# EAGLE design WagaGSM (EAGLE 8.7.1)

## Sheet 1 of 2: PROCESOR BOARD
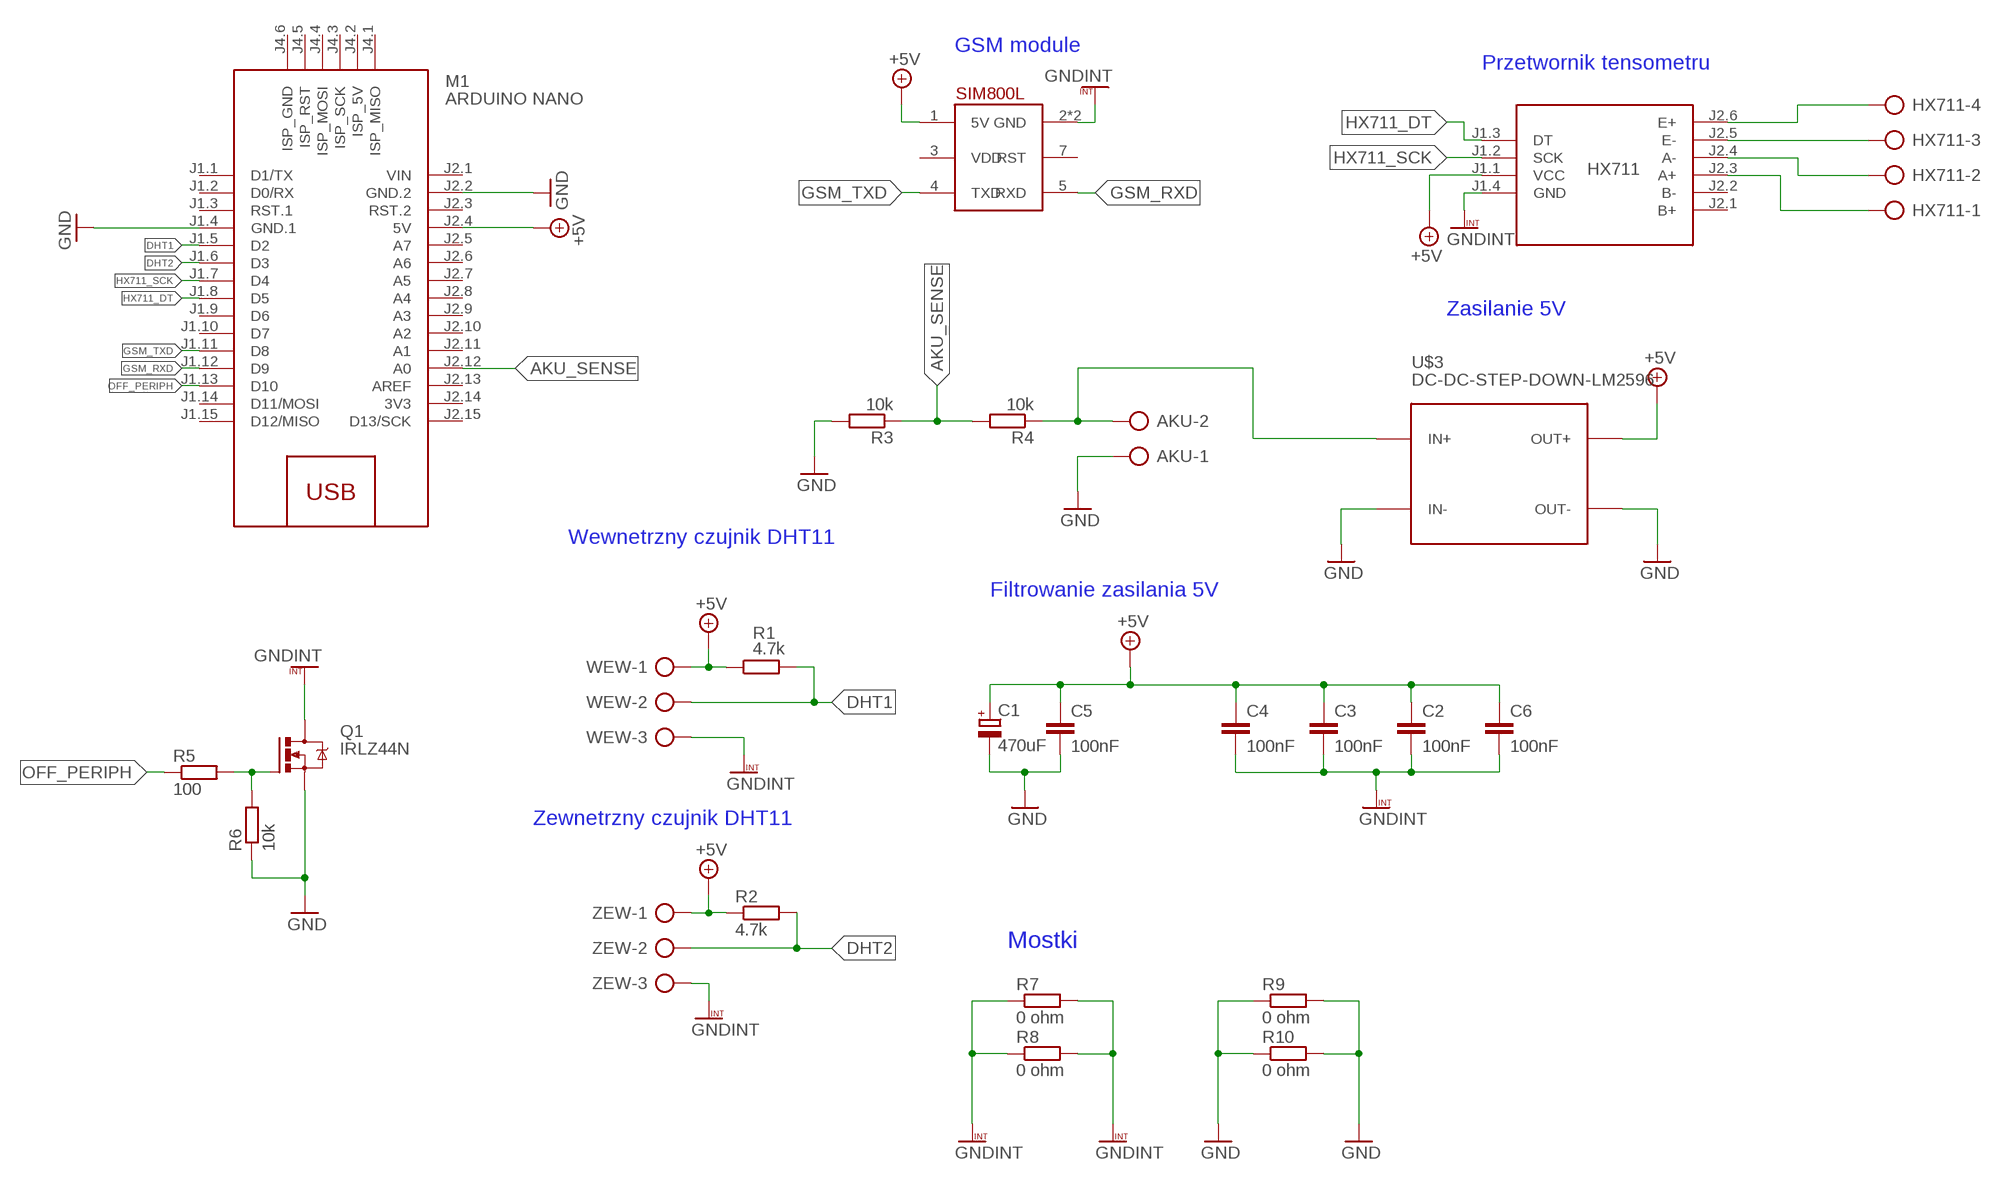
[diagram p0: schematic, sheet 1]

### Parts
AKU  AK500/2-H  [AK500/2-H]
C1  470uF  CPOL-EUE5-10.5  [E5-10,5]
C2  100nF  C-EU050-030X075  [C050-030X075]
C3  100nF  C-EU050-030X075  [C050-030X075]
C4  100nF  C-EU050-030X075  [C050-030X075]
C5  100nF  C-EU050-030X075  [C050-030X075]
C6  100nF  C-EU050-030X075  [C050-030X075]
HX711  AK300/4  [AK300/4]
M1  ARDUINO NANO  ARDUINO-NANO-3.0#ISP  [ARDUINO-NANO-3.0#ISP]
Q1  IRLZ44N  IRFZ48Z  [TO220BH]
R1  4.7k  R-EU_0204/7  [0204/7]
R2  4.7k  R-EU_0204/7  [0204/7]
R3  10k  R-EU_0207/10  [0207/10]
R4  10k  R-EU_0207/10  [0207/10]
R5  100  R-EU_0207/7  [0207/7]
R6  10k  R-EU_0207/7  [0207/7]
R7  0 ohm  R-EU_0204/7  [0204/7]
R8  0 ohm  R-EU_0204/7  [0204/7]
R9  0 ohm  R-EU_0204/7  [0204/7]
R10  0 ohm  R-EU_0204/7  [0204/7]
U$1  SIM800L  [SIP]
U$2  HX711  [HX711]
U$3  DC-DC-STEP-DOWN-LM2596  [DC-DC-STEP-DOWN-LM2596]
WEW  AK500/3-H  [AK500/3-H]
ZEW  AK500/3-H  [AK500/3-H]

### Nets
+5V: C1.+ C2.1 C3.1 C4.1 C5.1 C6.1 M1.J2.4(5V) R1.1 R2.1 U$1.1(5V) U$2.J1.1(VCC) U$3.OUT+ WEW.1 ZEW.1
AKU_SENSE: M1.J2.12(A0) R3.1 R4.2
DHT1: M1.J1.5(D2) R1.2 WEW.2
DHT2: M1.J1.6(D3) R2.2 ZEW.2
GND: AKU.1 C1.- C5.2 M1.J1.4(GND.1) M1.J2.2(GND.2) Q1.S R3.2 R6.1 R9.1 R9.2 R10.1 R10.2 U$3.IN- U$3.OUT-
GNDINT: C2.2 C3.2 C4.2 C6.2 Q1.D R7.1 R7.2 R8.1 R8.2 U$1.2(GND) U$1.6(GND) U$2.J1.4(GND) WEW.3 ZEW.3
GSM_RXD: M1.J1.12(D9) U$1.5(RXD)
GSM_TXD: M1.J1.11(D8) U$1.4(TXD)
HX711_DT: M1.J1.8(D5) U$2.J1.3(DT)
HX711_SCK: M1.J1.7(D4) U$2.J1.2(SCK)
N$1: Q1.G R5.2 R6.2
N$3: AKU.2 R4.1 U$3.IN+
N$9: HX711.4 U$2.J2.6(E+)
N$10: HX711.3 U$2.J2.5(E-)
N$11: HX711.2 U$2.J2.4(A-)
N$12: HX711.1 U$2.J2.3(A+)
OFF_PERIPH: M1.J1.13(D10) R5.1
Unconnected: M1.J1.1(D1/TX) M1.J1.2(D0/RX) M1.J1.3(RST.1) M1.J1.9(D6) M1.J1.10(D7) M1.J1.14(D11/MOSI) M1.J1.15(D12/MISO) M1.J2.3(RST.2) M1.J2.5(A7) M1.J2.6(A6) M1.J2.7(A5) M1.J2.8(A4) M1.J2.9(A3) M1.J2.10(A2) M1.J2.11(A1) M1.J2.13(AREF) M1.J2.15(D13/SCK) M1.J4.1(ISP_MISO) M1.J4.2(ISP_5V) M1.J4.3(ISP_SCK) M1.J4.4(ISP_MOSI) M1.J4.5(ISP_RST) M1.J4.6(ISP_GND) U$1.3(VDD) U$1.7(RST) U$2.J2.1(B+)

### Notes on the sheet
- GSM module
- Przetwornik tensometru
- Zasilanie 5V
- Wewnetrzny czujnik DHT11
- Filtrowanie zasilania 5V
- Zewnetrzny czujnik DHT11
- Mostki

## Sheet 2 of 2: SUPPLY BOARD

## Power pins joined to a net without a drawn wire
3V3: M1.J2.14(3V3)
B-: U$2.J2.2(B-)
VIN: M1.J2.1(VIN)

## Library data of the parts
AKU = con-ptr500:AK500/2-H: CONNECTOR Aug. 2004 / PTR Meßtechnik: Die Bezeichnung der Serie AK505 wurde geändert. Es handelt sich hierbei um AK500 in horizontaler Ausführung.; OC_FARNELL: unknown; OC_NEWARK: unknown
C1 = rcl:CPOL-EU: POLARIZED CAPACITOR, European symbol
C2-C6 = rcl:C-EU: CAPACITOR, European symbol
HX711 = con-ptr500:AK300/4: CONNECTOR; OC_FARNELL: unknown; OC_NEWARK: unknown
M1 = 000_diy-modules:ARDUINO-NANO-3.0#ISP: Arduino Nano 3.0 (and compatible devices) with ISP pads More details available here: https://www.arduino.cc/en/Main/ArduinoBoardNano Click here to find device on ebay.com <http://www.ebay.com/sch/arduino+nano>
Q1 = transistor-power:IRFZ48: N Channel HEXFET® Power MOSFET Logic Level Source: http://www.irf.com/product-info/datasheets/data/irfz48z.pdf
R1-R10 = rcl:R-EU_: RESISTOR, European symbol
U$1 = SIM800L:SIM800L: SIM800L Blue EVB Board with Level Translation and diode dropper.
U$2 = 000_MojeElementy:HX711: Płytka z układem HX711 do obługi belek tensometrycznych
U$3 = 000_diy-modules:DC-DC-STEP-DOWN-LM2596: DC/DC Step-Down Regulator based on LM2596-ADJ chip LM2596 datasheet available here: http://www.ti.com/lit/ds/symlink/lm2596.pdf Click here to find device on ebay.com <http://www.ebay.com/sch/lm2596+power+regulator>
WEW ZEW = con-ptr500:AK500/3-H: CONNECTOR Aug. 2004 / PTR Meßtechnik: Die Bezeichnung der Serie AK505 wurde geändert. Es handelt sich hierbei um AK500 in horizontaler Ausführung.; OC_FARNELL: unknown; OC_NEWARK: unknown

## Board
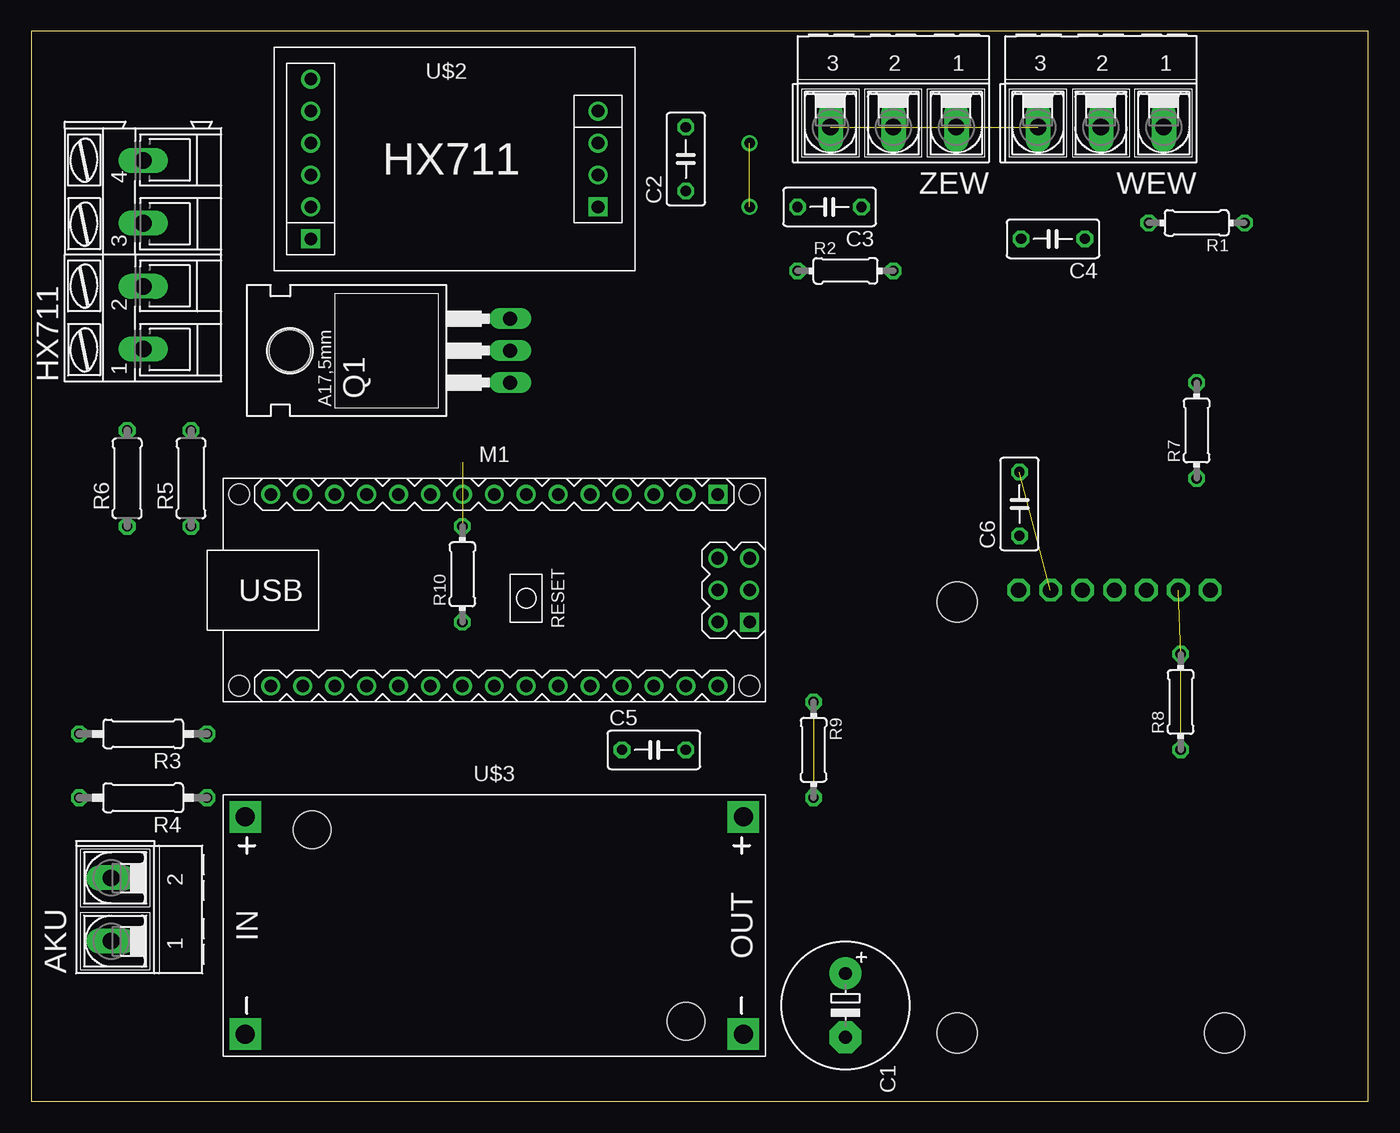
[diagram p1: board, top side]
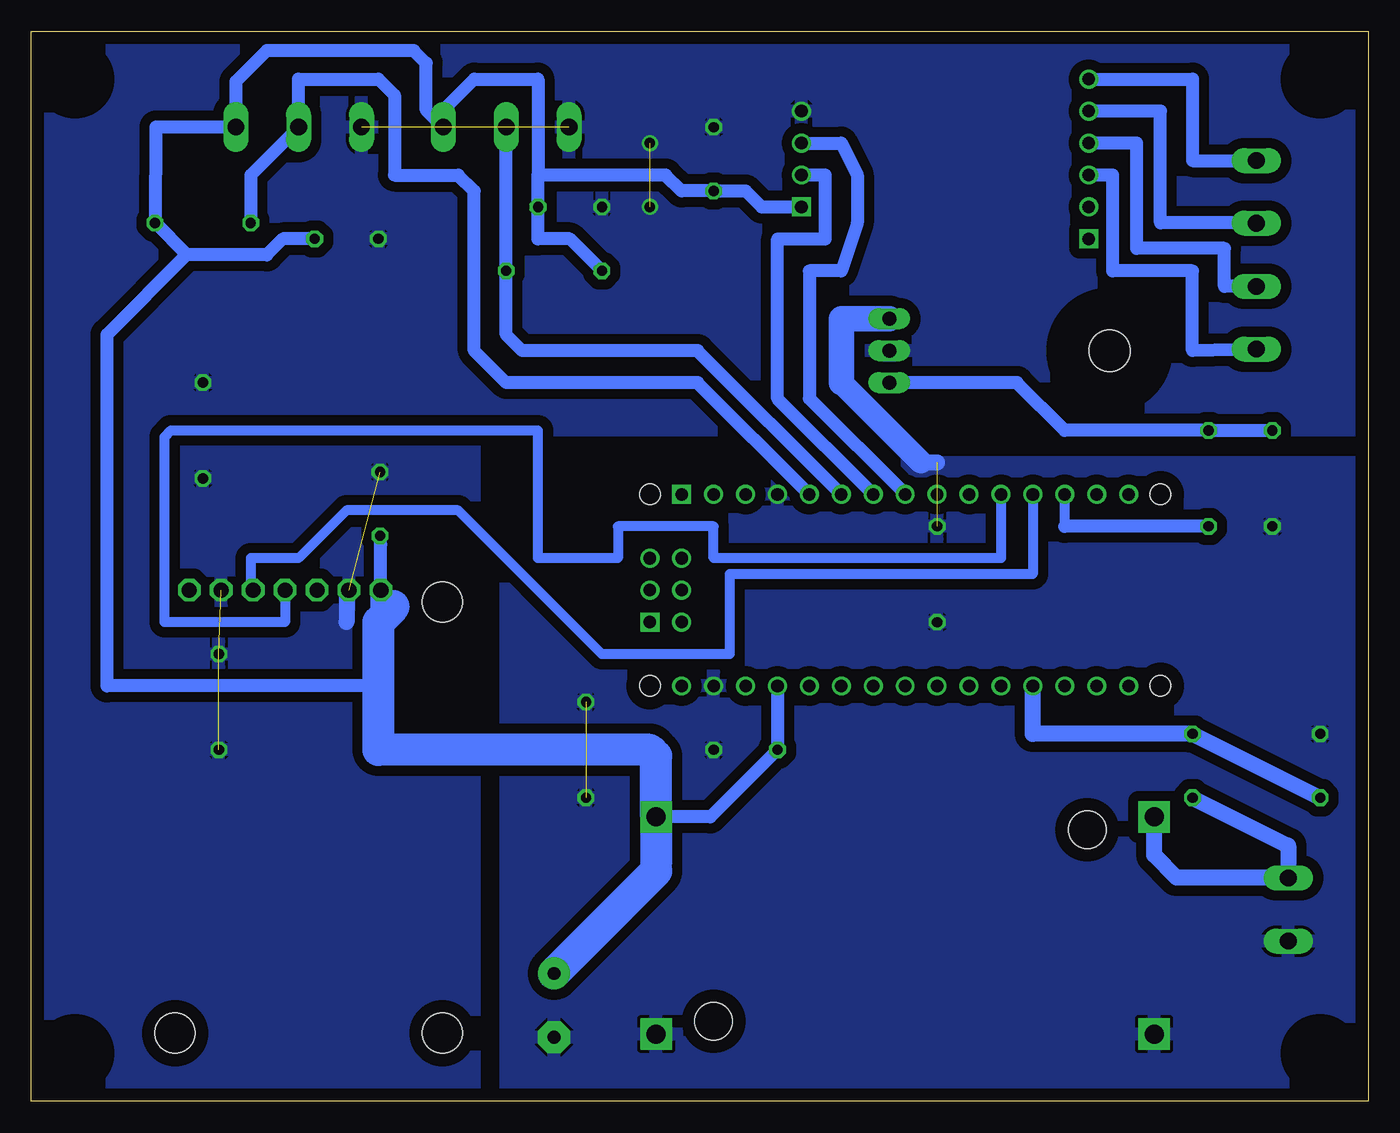
[diagram p2: board, bottom side, seen from below]

Size 106.35 x 85.08 mm. Coordinates in mm from the lower left corner, seen from the top.
Outline: 0,0 106.35,0 106.35,85.08 0,85.08 0,0
Copper layers (1*16): Top 0.035mm / dielectric 1.5mm / Bottom 0.035mm
Design rules "default": minimum track width 6mil, minimum drill 0.35mm, track to track 6mil, track to pad 6mil, pad to pad 6mil, via to via 6mil, smd to smd 6mil, copper to edge 40mil, drill to drill 6mil, minimum pad ring 10mil, minimum via ring 8mil, stop-mask expansion 4mil, vias tented up to drill 0mil, thermal gap 10mil
bRestrict: area 101.1,2 to 104.7,5.6; area 2,2 to 5.6,5.6; area 2,79.5 to 5.6,83.1; area 101.1,2 to 104.7,5.6; area 101.1,79.5 to 104.7,83.1

### Footprints (pad centres in the part's own frame; a part is rotated, then mirrored left to right if it is on the bottom)
AK500/2-H = drill 1.321 long: 1 -2.515,0; 2 2.515,0
E5-10,5 = drill 1.016 pad 2.54: + -2.54,0 | drill 1.016 pad 2.54 octagon: - 2.54,0
C050-030X075 = drill 0.813 octagon: 1 -2.54,0; 2 2.54,0
AK300/4 = drill 1.321 long: 1 -7.493,0; 2 -2.515,0; 3 2.515,0; 4 7.493,0
ARDUINO-NANO-3.0#ISP = drill 1 square: J1.1 17.78,7.62; J4.1 20.32,-2.54 | drill 1: J1.2 15.24,7.62; J1.3 12.7,7.62; J1.4 10.16,7.62; J1.5 7.62,7.62; J1.6 5.08,7.62; J1.7 2.54,7.62; J1.8 0,7.62; J1.9 -2.54,7.62; J1.10 -5.08,7.62; J1.11 -7.62,7.62; J1.12 -10.16,7.62; J1.13 -12.7,7.62; J1.14 -15.24,7.62; J1.15 -17.78,7.62; J2.1 17.78,-7.62; J2.2 15.24,-7.62; J2.3 12.7,-7.62; J2.4 10.16,-7.62; J2.5 7.62,-7.62; J2.6 5.08,-7.62; J2.7 2.54,-7.62; J2.8 0,-7.62; J2.9 -2.54,-7.62; J2.10 -5.08,-7.62; J2.11 -7.62,-7.62; J2.12 -10.16,-7.62; J2.13 -12.7,-7.62; J2.14 -15.24,-7.62; J2.15 -17.78,-7.62; J4.2 17.78,-2.54; J4.3 20.32,0; J4.4 17.78,0; J4.5 20.32,2.54; J4.6 17.78,2.54 | hole 1.651: -20.32,7.62; -20.32,-7.62; 20.32,-7.62; 20.32,7.62
TO220BH = drill 1.118 long: D 0,-6.35; G -2.54,-6.35; S 2.54,-6.35 | hole 3.302: 0,11.176
0204/7 = drill 0.813 octagon: 1 -3.81,0; 2 3.81,0
0207/10 = drill 0.813 octagon: 1 -5.08,0; 2 5.08,0
0207/7 = drill 0.813 octagon: 1 -3.81,0; 2 3.81,0
SIP = drill 1.2 octagon: 1 38.1,19.24; 2 38.1,16.7; 3 38.1,14.16; 4 38.1,11.62; 5 38.1,9.08; 6 38.1,6.54; 7 38.1,4 | hole 3.2: 2.87,24.13; 2.87,2.87; 37.16,24.13
HX711 = drill 1 square: J1.1 12.065,-3.81; J2.1 -10.795,-6.35 | drill 1: J1.2 12.065,-1.27; J1.3 12.065,1.27; J1.4 12.065,3.81; J2.2 -10.795,-3.81; J2.3 -10.795,-1.27; J2.4 -10.795,1.27; J2.5 -10.795,3.81; J2.6 -10.795,6.35
DC-DC-STEP-DOWN-LM2596 = drill 1.5 pad 2.5 square: IN+ -19.812,8.636; IN- -19.812,-8.636; OUT+ 19.812,8.636; OUT- 19.812,-8.636 | hole 3: -14.478,7.62; 15.24,-7.62
AK500/3-H = drill 1.321 long: 1 -5.004,0; 2 0,0; 3 5.004,0

### Placement (x,y rotation side)
AKU  6.35,15.24 90 top
C1  64.77,7.62 270 top
C2  52.07,74.93 90 top
C3  63.5,71.12 180 top
C4  81.28,68.58 180 top
C5  49.53,27.94 0 top
C6  78.61,47.5 90 top
HX711  8.89,67.31 90 top
M1  36.83,40.64 0 top
Q1  31.75,59.69 90 top
R1  92.71,69.85 180 top
R2  64.77,66.04 0 top
R3  8.89,29.21 180 top
R4  8.89,24.13 180 top
R5  12.7,49.53 90 top
R6  7.62,49.53 90 top
R7  92.71,53.34 90 top
R8  91.44,31.75 90 top
R9  62.23,27.94 270 top
R10  34.29,41.91 90 top
U$1  97.79,2.54 90 top
U$2  33.02,74.93 0 top
U$3  36.83,13.97 0 top
WEW  85.09,77.47 180 top
ZEW  68.58,77.47 180 top

### Tracks (layer width: path | path; a pad name or v marks a point on that pad's centre or on a via)
+5V
  Bottom 1.016: U$2.J1.1 48.26,71.12 49.53,72.39 C2.1 54.61,72.39 55.88,73.66 66.04,73.66 | 66.04,73.66 66.04,81.28 71.12,81.28 73.58,78.82 ZEW.1 74.93,78.82 74.93,82.55 75.94,83.56 87.63,83.56 90.09,81.09 WEW.1 96.44,77.47 R1.1 93.98,67.31 | R2.1 63.5,68.58 66.04,68.58 C3.1 66.04,73.66 | C4.1 86.36,68.58 87.63,67.31 93.98,67.31 | C6.1 78.55,44.26 U$1.1 78.55,33.21 78.74,33.02 100.33,33.02 100.33,60.96 93.98,67.31 | M1.J2.4 C5.1 52.32,22.61 U$3.OUT+
  Bottom 1.27: 56.64,19.05 56.64,18.29 | 78.74,38.1 78.74,40.45 U$1.1
  Bottom 2.54: C1.+ 56.64,18.29 | 56.64,19.05 U$3.OUT+ 56.64,27.43 57.15,27.94 78.74,27.94 78.74,38.1 77.55,39.29 77.55,39.37
AKU_SENSE
  Bottom 1.27: R4.2 R3.1 26.67,29.21 M1.J2.12
DHT1
  Bottom 1.016: M1.J1.5 53.34,57.15 68.58,57.15 71.12,59.69 71.12,72.39 72.39,73.66 77.47,73.66 77.47,80.01 78.74,81.28 85.09,81.28 WEW.2 88.9,73.66 R1.2
DHT2
  Bottom 1.016: ZEW.2 R2.2 68.58,60.96 67.31,59.69 53.34,59.69 M1.J1.6
GND  (2 unrouted)
  Bottom 1.27: 35.56,50.8 34.29,50.8
  Bottom 1.778: 41.91,57.15 35.56,50.8
  Bottom 2.032: Q1.S 41.91,62.23 41.91,57.15
  pour Bottom (isolate 0.813): 0,50.8 0,0 68.58,0 68.58,50.8
GNDINT  (via drill 0.85 pad 1.15)  (5 unrouted)
  Bottom 1.27: U$1.2 81.28,40.45 81.28,38.1
  other vias: 57.15,71.12 57.15,76.2
  pour Bottom (isolate 0.813): 106.68,0 106.68,85.09 0,85.09 0,53.34 71.12,53.34 71.12,0
GSM_RXD
  Bottom 0.813: M1.J1.12 26.67,41.91 50.8,41.91 50.8,35.56 60.96,35.56 72.39,46.99 81.28,46.99 85.09,43.18 88.9,43.18 88.9,40.83 U$1.5
GSM_TXD
  Bottom 0.813: M1.J1.11 29.21,43.18 52.07,43.18 52.07,45.72 59.69,45.72 59.69,43.18 66.04,43.18 66.04,53.34 95.25,53.34 95.76,52.83 95.76,38.1 86.17,38.1 U$1.4
HX711_DT
  Bottom 1.016: M1.J1.8 44.45,55.88 44.45,66.04 41.91,66.04 40.64,69.85 40.64,73.66 41.91,76.2 U$2.J1.3
HX711_SCK
  Bottom 1.016: M1.J1.7 46.99,55.88 46.99,68.58 43.18,68.58 43.18,73.66 U$2.J1.2
N$1
  Bottom 1.016: Q1.G 27.94,57.15 24.13,53.34 R5.2 R6.2
N$3
  Bottom 1.27: R4.1 6.35,20.32 AKU.2 6.38,17.78 15.24,17.78 17.02,19.56 U$3.IN+
N$9
  Bottom 1.016: U$2.J2.6 13.97,81.28 13.97,74.8 HX711.4
N$10
  Bottom 1.016: HX711.3 8.89,69.85 16.51,69.85 16.51,78.74 U$2.J2.5
N$11
  Bottom 1.016: HX711.2 11.43,64.8 11.43,67.82 18.41,67.82 18.41,76.2 U$2.J2.4
N$12
  Bottom 1.016: HX711.1 13.97,59.69 13.97,66.04 20.32,66.04 20.32,73.66 U$2.J2.3
OFF_PERIPH
  Bottom 0.813: 24.13,45.72 M1.J1.13
  Bottom 1.016: R5.1 24.13,45.72

### Text on the board
tValues: uliot.cba.pl